# EAGLE board P1001-001-003-320 - Controller (EAGLE 9.4.2), part 1 of 3
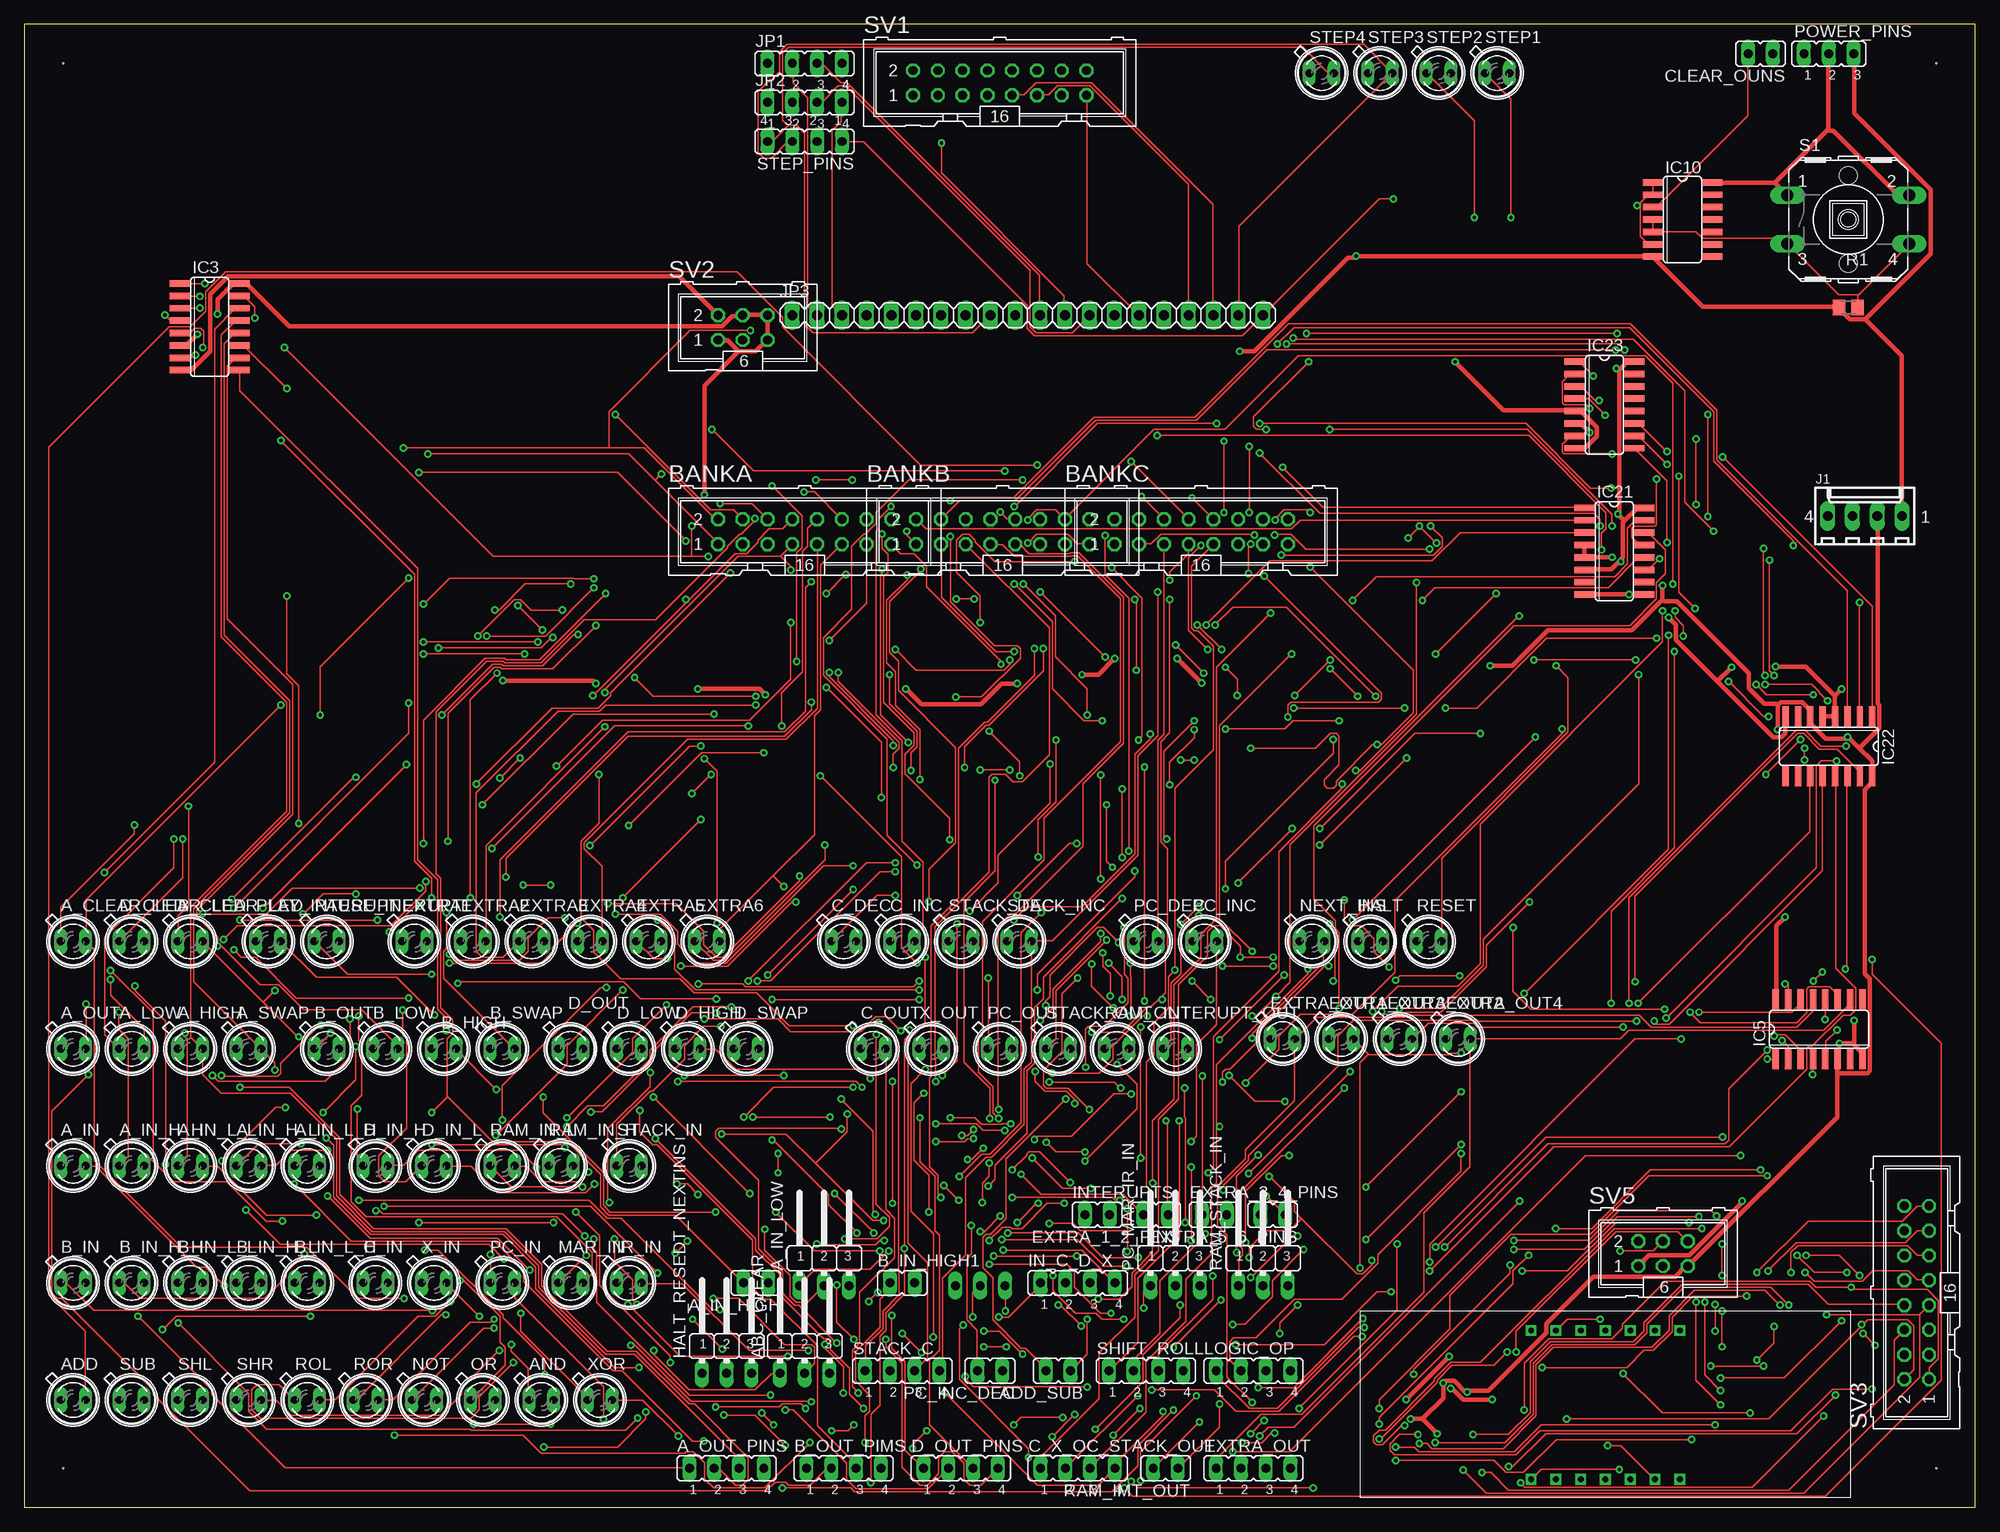
[diagram p4: board, top side]
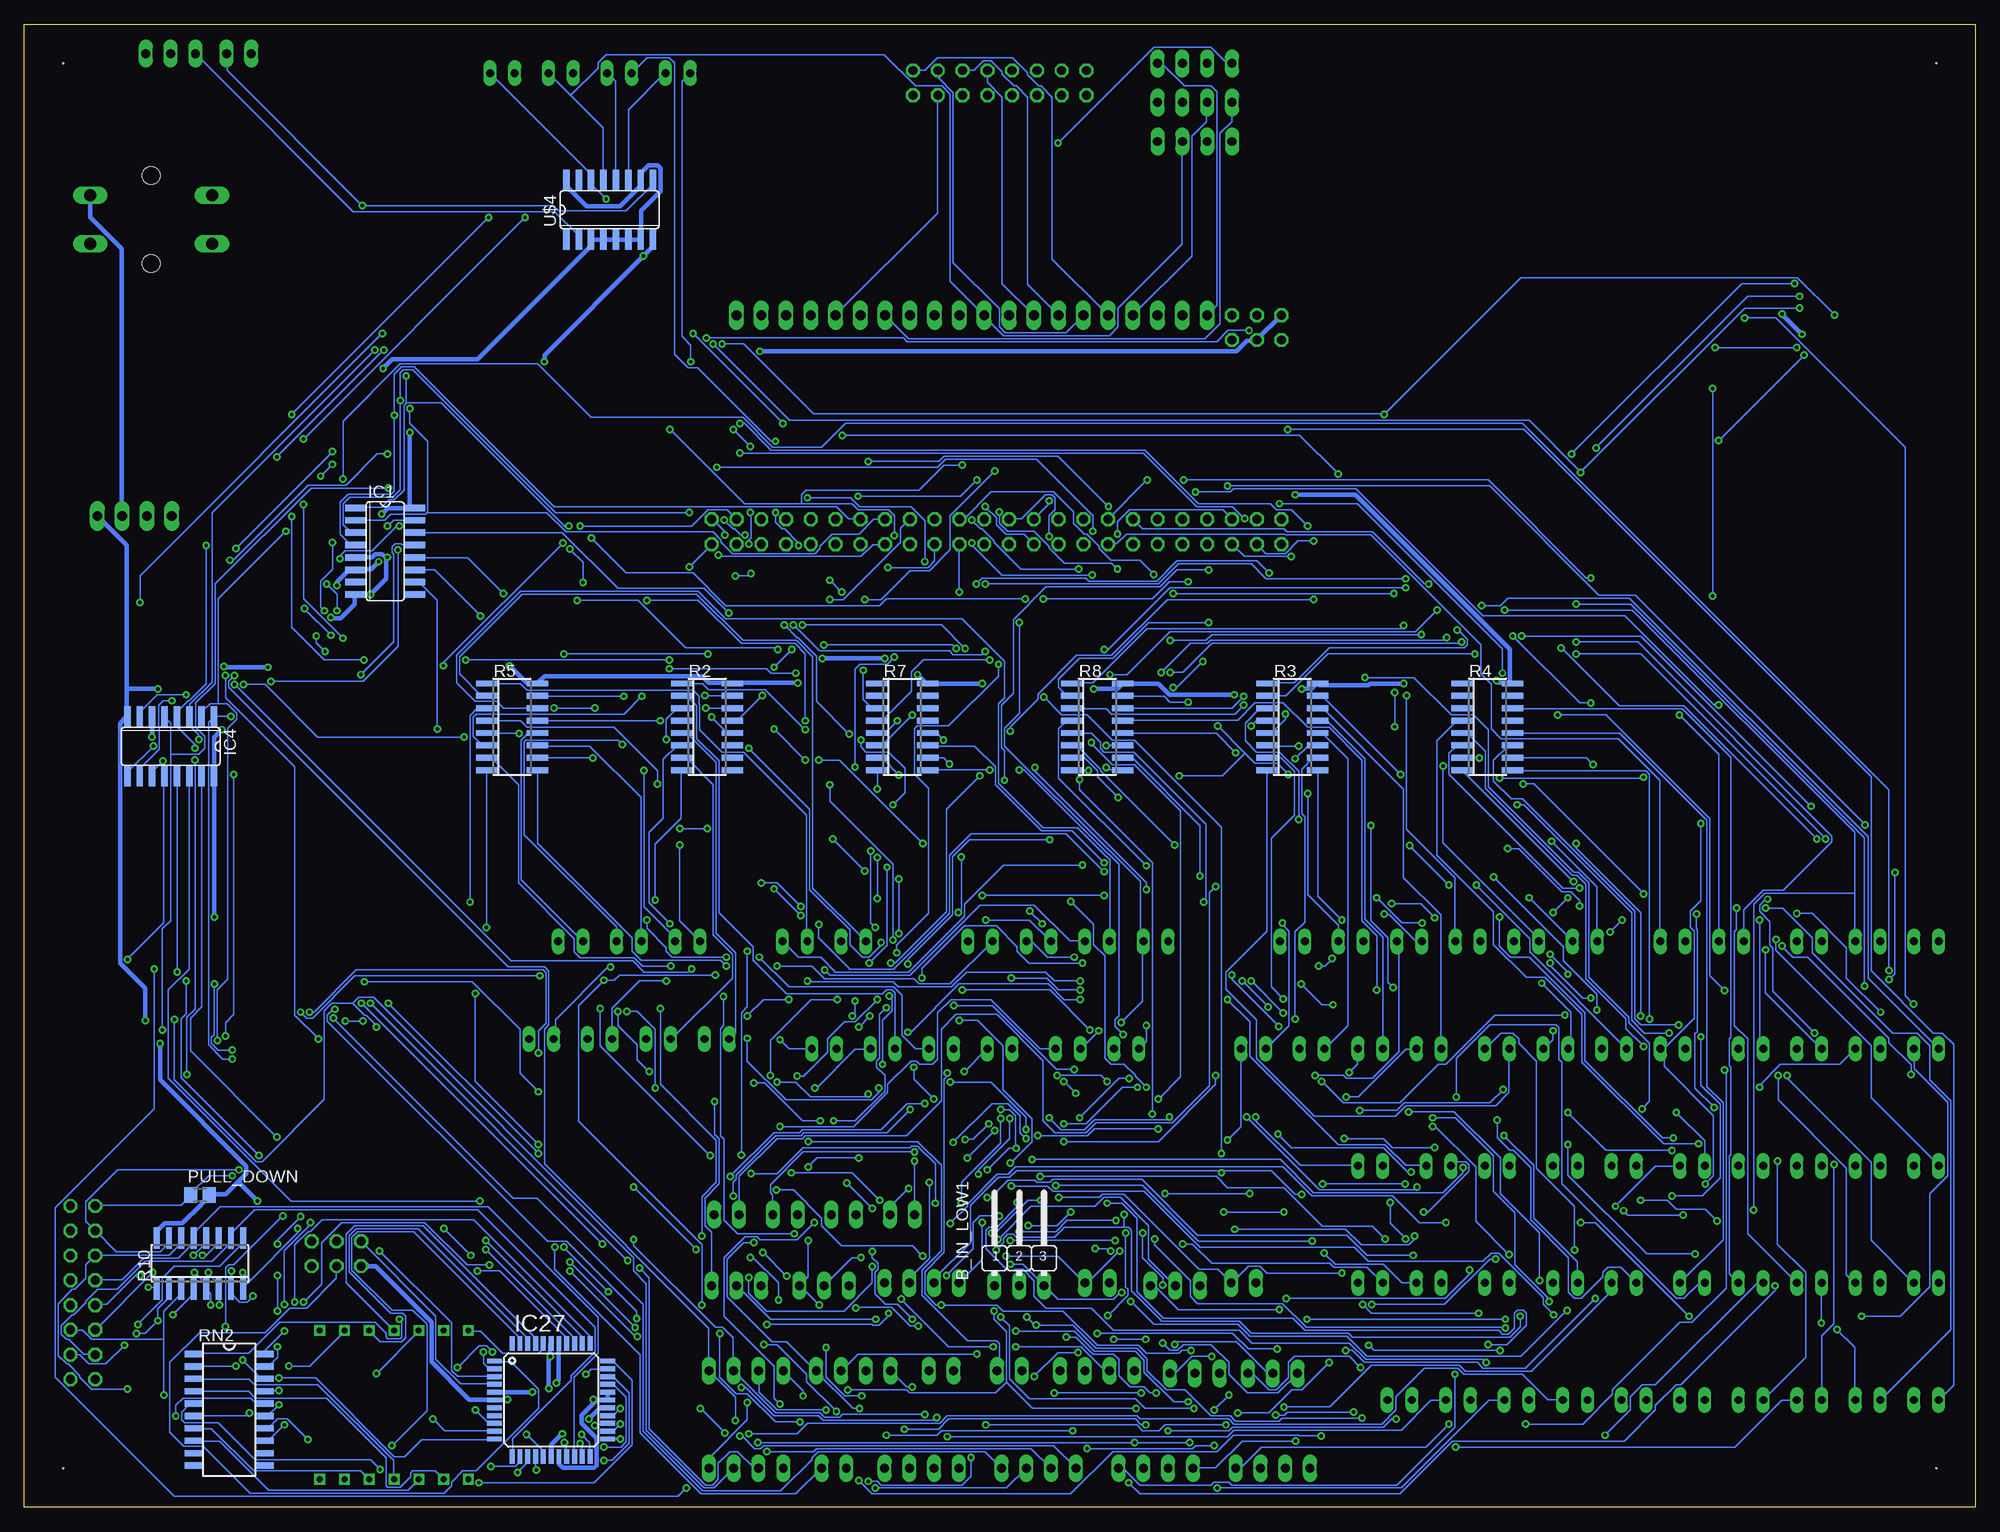
[diagram p5: board, bottom side, seen from below]

Size 200 x 152 mm. Coordinates in mm from the lower left corner, seen from the top.
Outline: 0,0 200,0 200,152 0,152 0,0
Copper layers (1*16): Top 0.035mm / dielectric 1.5mm / Bottom 0.035mm
Design rules "default *": minimum track width 6mil, minimum drill 0.35mm, track to track 6mil, track to pad 6mil, pad to pad 6mil, via to via 6mil, smd to smd 6mil, copper to edge 40mil, drill to drill 6mil, minimum pad ring 10mil, minimum via ring 8mil, stop-mask expansion 4mil, vias tented up to drill 0mil, thermal gap 10mil
Net classes: 1 power: width 0.457 mm
Holes 0.12 mm at 4,4 196,148 4,148 196,4

## Footprints (pad centres in the part's own frame; a part is rotated, then mirrored left to right if it is on the bottom)
SFH482 = drill 0.813 long: A -1.27,0; K 1.27,0
JP1 = drill 0.914 long: 1 0,-1.27; 2 0,1.27
JP2W = drill 0.914 long: 1 -2.54,-1.27; 2 0,-1.27; 3 2.54,-1.27
JP4 = drill 0.914 long: 1 -3.81,0; 2 -1.27,0; 3 1.27,0; 4 3.81,0
ML16 = drill 0.914 octagon: 1 -8.89,-1.27; 2 -8.89,1.27; 3 -6.35,-1.27; 4 -6.35,1.27; 5 -3.81,-1.27; 6 -3.81,1.27; 7 -1.27,-1.27; 8 -1.27,1.27; 9 1.27,-1.27; 10 1.27,1.27; 11 3.81,-1.27; 12 3.81,1.27; 13 6.35,-1.27; 14 6.35,1.27; 15 8.89,-1.27; 16 8.89,1.27
SO16 = smd 0.66 x 2.032: 1 -4.445,-3.073; 2 -3.175,-3.073; 3 -1.905,-3.073; 4 -0.635,-3.073; 5 0.635,-3.073; 6 1.905,-3.073; 7 3.175,-3.073; 8 4.445,-3.073; 9 4.445,3.073; 10 3.175,3.073; 11 1.905,3.073; 12 0.635,3.073; 13 -0.635,3.073; 14 -1.905,3.073; 15 -3.175,3.073; 16 -4.445,3.073
SO14 = smd 0.66 x 2.032: 1 -3.81,-3.073; 2 -2.54,-3.073; 3 -1.27,-3.073; 4 0,-3.073; 5 1.27,-3.073; 6 2.54,-3.073; 7 3.81,-3.073; 8 3.81,3.073; 9 2.54,3.073; 10 1.27,3.073; 11 0,3.073; 12 -1.27,3.073; 13 -2.54,3.073; 14 -3.81,3.073
TQFP44 = smd 1.5 x 0.5: 1 -5.8,4; 2 -5.8,3.2; 3 -5.8,2.4; 4 -5.8,1.6; 5 -5.8,0.8; 6 -5.8,0; 7 -5.8,-0.8; 8 -5.8,-1.6; 9 -5.8,-2.4; 10 -5.8,-3.2; 11 -5.8,-4; 23 5.8,-4; 24 5.8,-3.2; 25 5.8,-2.4; 26 5.8,-1.6; 27 5.8,-0.8; 28 5.8,0; 29 5.8,0.8; 30 5.8,1.6; 31 5.8,2.4; 32 5.8,3.2; 33 5.8,4 | smd 0.5 x 1.5: 12 -4,-5.8; 13 -3.2,-5.8; 14 -2.4,-5.8; 15 -1.6,-5.8; 16 -0.8,-5.8; 17 0,-5.8; 18 0.8,-5.8; 19 1.6,-5.8; 20 2.4,-5.8; 21 3.2,-5.8; 22 4,-5.8; 34 4,5.8; 35 3.2,5.8; 36 2.4,5.8; 37 1.6,5.8; 38 0.8,5.8; 39 0,5.8; 40 -0.8,5.8; 41 -1.6,5.8; 42 -2.4,5.8; 43 -3.2,5.8; 44 -4,5.8
6410-04 = drill 1.016 long: 1 3.81,0; 2 1.27,0; 3 -1.27,0; 4 -3.81,0
1X20 = drill 1.016 long: 1 -24.13,0; 2 -21.59,0; 3 -19.05,0; 4 -16.51,0; 5 -13.97,0; 6 -11.43,0; 7 -8.89,0; 8 -6.35,0; 9 -3.81,0; 10 -1.27,0; 11 1.27,0; 12 3.81,0; 13 6.35,0; 14 8.89,0; 15 11.43,0; 16 13.97,0; 17 16.51,0; 18 19.05,0; 19 21.59,0; 20 24.13,0
JP2 = drill 0.914 long: 1 -2.54,0; 2 0,0; 3 2.54,0
M0805 = smd 1.3 x 1.6: 1 -0.95,0; 2 0.95,0
SO16' = smd 0.6 x 2.2: 1 -4.445,-2.6; 2 -3.175,-2.6; 3 -1.905,-2.6; 4 -0.635,-2.6; 5 0.635,-2.6; 6 1.905,-2.6; 7 3.175,-2.6; 8 4.445,-2.6; 9 4.445,2.6; 10 3.175,2.6; 11 1.905,2.6; 12 0.635,2.6; 13 -0.635,2.6; 14 -1.905,2.6; 15 -3.175,2.6; 16 -4.445,2.6
SOMC20 = smd 1.91 x 0.64: 1 -3.62,5.715; 2 -3.62,4.445; 3 -3.62,3.175; 4 -3.62,1.905; 5 -3.62,0.635; 6 -3.62,-0.635; 7 -3.62,-1.905; 8 -3.62,-3.175; 9 -3.62,-4.445; 10 -3.62,-5.715; 11 3.62,-5.715; 12 3.62,-4.445; 13 3.62,-3.175; 14 3.62,-1.905; 15 3.62,-0.635; 16 3.62,0.635; 17 3.62,1.905; 18 3.62,3.175; 19 3.62,4.445; 20 3.62,5.715
B3F-40XX = drill 1.194 long: 1 -6.248,2.489; 2 6.248,2.489; 3 -6.248,-2.489; 4 6.248,-2.489 | hole 1.803: 0,-4.496; 0,4.496
ML6 = drill 0.914 octagon: 1 -2.54,-1.27; 2 -2.54,1.27; 3 0,-1.27; 4 0,1.27; 5 2.54,-1.27; 6 2.54,1.27
4-DIGIT-7-SEGMENT = drill 0.6 square: PIN1 17.48,1.88; PIN2 20.02,1.88; PIN3 22.56,1.88; PIN4 25.1,1.88; PIN5 27.64,1.88; PIN6 30.18,1.88; PIN7 32.72,1.88; PIN8 32.72,17.12; PIN9 30.18,17.12; PIN10 27.64,17.12; PIN11 25.1,17.12; PIN12 22.56,17.12; PIN13 20.02,17.12; PIN14 17.48,17.12

## Placement (x,y rotation side)
A_CLEAR_LED  [SFH482]  5,58 0 top
A_HIGH  [SFH482]  17,47 0 top
A_IN  [SFH482]  5,35 0 top
A_IN_H_H  [SFH482]  11,35 0 top
A_IN_H_L  [SFH482]  23,35 0 top
A_IN_HIGH  [JP1]  75,23 90 top
A_IN_L_H  [SFH482]  29,35 0 top
A_IN_L_L  [SFH482]  17,35 0 top
A_IN_LOW  [JP2W]  82,24 0 top
A_LOW  [SFH482]  11,47 0 top
A_OUT  [SFH482]  5,47 0 top
A_OUT_PINS  [JP4]  72,4 0 top
A_SWAP  [SFH482]  23,47 0 top
ABC_CLEAR  [JP2W]  80,15 0 top
ADD  [SFH482]  5,11 0 top
ADD_SUB  [JP1]  106,14 90 top
AND  [SFH482]  53,11 0 top
B_CLEAR_LED  [SFH482]  17,58 0 top
B_HIGH  [SFH482]  43,47 0 top
B_IN  [SFH482]  5,23 0 top
B_IN_H_H  [SFH482]  11,23 0 top
B_IN_H_L  [SFH482]  23,23 0 top
B_IN_HIGH1  [JP1]  90,23 270 top
B_IN_L_H  [SFH482]  29,23 0 top
B_IN_L_L  [SFH482]  17,23 0 top
B_IN_LOW1  [JP2W]  98,24 0 bottom
B_LOW  [SFH482]  37,47 0 top
B_OUT  [SFH482]  31,47 0 top
B_OUT_PIMS  [JP4]  84,4 0 top
B_SWAP  [SFH482]  49,47 0 top
BANKA  [ML16]  80,100 0 top
BANKB  [ML16]  100.32,100 0 top
BANKC  [ML16]  120.64,100 0 top
C_DEC  [SFH482]  84,58 0 top
C_IN  [SFH482]  36,23 0 top
C_INC  [SFH482]  90,58 0 top
C_OUT  [SFH482]  87,47 0 top
C_X_OC_STACK_OUT  [JP4]  108,4 0 top
CLEAR_OUNS  [JP1]  178,149 90 top
D_CLEAR_LED  [SFH482]  11,58 0 top
D_HIGH  [SFH482]  68,47 0 top
D_IN_H  [SFH482]  36,35 0 top
D_IN_L  [SFH482]  42,35 0 top
D_LOW  [SFH482]  62,47 0 top
D_OUT  [SFH482]  56,47 0 top
D_OUT_PINS  [JP4]  96,4 0 top
D_SWAP  [SFH482]  74,47 0 top
EXTRA1  [SFH482]  40,58 0 top
EXTRA2  [SFH482]  46,58 0 top
EXTRA3  [SFH482]  52,58 0 top
EXTRA4  [SFH482]  58,58 0 top
EXTRA5  [SFH482]  64,58 0 top
EXTRA6  [SFH482]  70,58 0 top
EXTRA_1_2_PINS  [JP1]  116,30 90 top
EXTRA_3_4_PINS  [JP1]  122,30 270 top
EXTRA_5_6_PINS  [JP1]  128,30 90 top
EXTRA_OUT  [JP4]  126,4 0 top
EXTRA_OUT1  [SFH482]  129,48 0 top
EXTRA_OUT2  [SFH482]  141,48 0 top
EXTRA_OUT3  [SFH482]  135,48 0 top
EXTRA_OUT4  [SFH482]  147,48 0 top
HALT  [SFH482]  138,58 0 top
HALT_RESEDT_NEXTINS  [JP2W]  72,15 0 top
IC1  74LS138D  [SO16]  163,98 270 bottom
IC3  74LS138D  [SO16]  19,121 270 top
IC4  74LS138D  [SO16]  185,78 180 bottom
IC5  74LS138D  [SO16]  184,49 0 top
IC10  74ALS00D  [SO14]  170,132 270 top
IC21  74LS138D  [SO16]  163,98 270 top
IC22  74LS138D  [SO16]  185,78 180 top
IC23  74LS138D  [SO16]  162,113 270 top
IC27  MEGA8535-A  [TQFP44]  146,11 0 bottom
IN_C_D_X  [JP4]  108,23 0 top
INTERUPT_OUT  [SFH482]  118,47 0 top
INTERUPTS  [JP1]  110,30 270 top
IR_IN  [SFH482]  62,23 0 top
J1  22-27-2041-04  [6410-04]  188.7,101.61 0 top
JP1  [JP4]  80,148 0 top
JP2  [JP4]  80,144 0 top
JP3  [1X20]  102.86,122.19 0 top
LOGIC_OP  [JP4]  126,14 0 top
MAR_IN  [SFH482]  56,23 0 top
NEXT_INS  [SFH482]  132,58 0 top
NOT  [SFH482]  41,11 0 top
OR  [SFH482]  47,11 0 top
PAUSE_INERUPT  [SFH482]  31,58 0 top
PC_DEC  [SFH482]  115,58 0 top
PC_IN  [SFH482]  49,23 0 top
PC_INC  [SFH482]  121,58 0 top
PC_INC_DEC  [JP1]  99,14 90 top
PC_MAR_IR_IN  [JP2W]  118,24 0 top
PC_OUT  [SFH482]  100,47 0 top
PLAY_INTERUPT  [SFH482]  25,58 0 top
POWER_PINS  [JP2]  185,149 0 top
PULL_DOWN  [M0805]  182,32 0 bottom
R1  [M0805]  187,123 0 top
R2  [SO16']  130,80 270 bottom
R3  [SO16']  70,80 270 bottom
R4  [SO16']  50,80 270 bottom
R5  [SO16']  150,80 270 bottom
R7  [SO16']  110,80 270 bottom
R8  [SO16']  90,80 270 bottom
R10  [SO16']  182,25 0 bottom
RAM_IMT_OUT  [JP1]  117,4 90 top
RAM_IN_H  [SFH482]  55,35 0 top
RAM_IN_L  [SFH482]  49,35 0 top
RAM_OUT  [SFH482]  112,47 0 top
RAM_STACK_IN  [JP2W]  127,24 0 top
RESET  [SFH482]  144,58 0 top
RN2  [SOMC20]  179,10 0 bottom
ROL  [SFH482]  29,11 0 top
ROR  [SFH482]  35,11 0 top
S1  [B3F-40XX]  187,132 0 top
SHIFT_ROLL  [JP4]  115,14 0 top
SHL  [SFH482]  17,11 0 top
SHR  [SFH482]  23,11 0 top
STACK_C  [JP4]  90,14 0 top
STACK_DEC  [SFH482]  96,58 0 top
STACK_IN  [SFH482]  62,35 0 top
STACK_INC  [SFH482]  102,58 0 top
STACK_OUT  [SFH482]  106,47 0 top
STEP1  [SFH482]  151,147 0 top
STEP2  [SFH482]  145,147 0 top
STEP3  [SFH482]  139,147 0 top
STEP4  [SFH482]  133,147 0 top
STEP_PINS  [JP4]  80,140 180 top
SUB  [SFH482]  11,11 0 top
SV1  [ML16]  100,146 0 top
SV2  [ML6]  73.65,120.92 0 top
SV3  [ML16]  194,22 90 top
SV5  [ML6]  168,26 0 top
U$1  4-DIGIT-7-SEGMENT  [4-DIGIT-7-SEGMENT]  137,1 0 top
U$4  SN74HC161  [SO16]  140,133 0 bottom
X_IN  [SFH482]  42,23 0 top
X_OUT  [SFH482]  93,47 0 top
XOR  [SFH482]  59,11 0 top

## Tracks (layer width: path | path; a pad name or v marks a point on that pad's centre or on a via)
!CLEAR  (via drill 0.35)
  Top 0.152: 165.66,133.43 165.66,133.73 166.42,134.49 166.88,134.49 IC10.2 166.95,134.57 166.95,135.79 IC10.1 | 165.66,133.43 165.66,130.3 166.5,129.46 166.88,129.46 IC10.6 | 165.66,133.43 v165.35,133.43
  Bottom 0.152: U$4.9 135.56,136.02 135.56,135.64 138.3,132.89 145.24,132.89 145.77,133.43 v165.35,133.43 179.22,147.29 179.22,148.97 CLEAR_OUNS.1
A  (via drill 0.35)
  Top 0.152: v153.54,24.23 158.19,24.23 163.14,29.18 v170.69,29.18 | v173.35,18.06 v173.35,20.8
  Bottom 0.152: v153.54,24.23 151.26,24.23 144.47,17.45 144.47,16.84 IC27.37 | v170.69,29.18 170.69,28.96 173.35,26.29 v173.35,20.8 | v173.35,18.06 175.34,16.08 175.34,15.77 RN2.20
B  (via drill 0.35)
  Top 0.152: v152.71,26.44 159.94,26.44 163.3,29.79 v171.68,29.79 | v174.04,23.77 v174.04,26.98 | v174.04,16.46 v174.04,20.12
  Bottom 0.152: v152.71,26.44 143.64,17.37 143.64,16.84 IC27.36 | v171.68,29.79 174.04,27.43 v174.04,26.98 | v174.04,20.12 v174.04,23.77 | v174.04,16.46 174.04,15.39 174.96,14.48 175.34,14.48 RN2.19
C  (via drill 0.35)
  Top 0.152: v152.71,27.36 160.4,27.36 163.45,30.4 172.97,30.4 v173.51,29.87 | v179.38,18.52 179.38,16.84 v177.62,15.09
  Bottom 0.152: v152.71,27.36 142.88,17.53 142.88,16.84 IC27.35 | v173.51,29.87 178.54,24.84 179.07,24.84 179.38,24.54 v179.38,18.52 | v177.62,15.09 175.72,13.18 175.41,13.18 RN2.18
CLEAR
  Top 0.152: IC10.3 166.95,133.27 167.34,133.27 176.71,142.65 176.71,148.97 CLEAR_OUNS.2
CLK
  Bottom 0.152: U$4.2 143.18,130 143.18,130.38 145.62,132.82 166.27,132.82 182.42,148.97 POWER_PINS.1
D  (via drill 0.35)
  Top 0.152: v172.29,21.03 172.29,13.56 v173.89,11.96
  Bottom 0.152: v172.29,21.03 172.29,26.9 170.92,28.27 170.69,28.27 169.47,29.49 153.92,29.49 142.04,17.6 142.04,16.84 IC27.34 | v173.89,11.96 175.34,11.96 RN2.17
DATAA0  (via drill 0.35)
  Top 0.152: v178.69,45.95 179.53,45.95 IC5.1 | v18.52,125.42 16,125.42 IC3.1 | v41.38,107.97 61.95,107.97 64.66,105.27 | 64.66,105.27 71.17,98.75 BANKA.1 | v178.84,81.08 178.31,81.08 v174.73,84.66 | v161.7,98.15 161.7,99.82 162.15,100.28 162.15,101.96 154.23,109.88 v116.13,109.88 | 64.66,105.27 v65.3,105.92
  Bottom 0.152: v178.69,45.95 179.68,45.95 181.13,47.4 181.13,80.47 180.59,81 IC4.1 180.52,81.08 v178.84,81.08 | v18.52,125.42 23.93,125.42 v41.38,107.97 | v174.73,84.66 165.28,84.66 161.7,88.24 v161.7,98.15 | v116.13,109.88 69.27,109.88 v65.3,105.92
DATAA1  (via drill 0.35)
  Top 0.152: v180.21,47.85 180.82,47.24 180.82,45.95 IC5.2 | v17.98,124.13 16,124.13 IC3.2 | 59.97,108.58 63.55,108.58 70.79,101.35 71.09,101.35 BANKA.2 | 59.97,108.58 v38.86,108.58 | v173.2,100.05 170.23,103.02 170.23,114.45 164.97,119.71 130.23,119.71 v130.07,119.86 | v74.45,120.62 68.28,120.62 59.97,112.32 59.97,108.58
  Bottom 0.152: v180.21,47.85 180.21,53.03 179.15,54.1 179.15,79.86 178.23,80.77 178.23,81.38 179.22,82.37 180.14,82.37 | 180.14,82.37 180.97,82.37 181.81,81.53 IC4.2 | v17.98,124.13 23.32,124.13 v38.86,108.58 | 180.14,82.37 180.14,93.12 v173.2,100.05 | v130.07,119.86 109.88,119.86 109.5,119.48 77.72,119.48 76.58,120.62 v74.45,120.62
DATAA2  (via drill 0.35)
  Top 0.152: v179.38,48.31 179.53,48.46 180.52,48.46 182.04,46.94 182.04,45.95 IC5.3 | v182.12,78.72 v178.54,75.13 | v17.98,122.91 16,122.91 IC3.3 | v40.46,106.07 60.81,106.07 v67.82,99.06 | v164.06,118.64 163.45,119.25 v129.39,119.25
  Bottom 0.152: v179.38,48.31 179.38,49.68 178.54,50.52 v178.54,75.13 | v182.12,78.72 182.12,79.17 183.03,80.09 183.03,81 IC4.3 183.03,81.08 183.03,82.3 180.75,84.58 180.75,101.96 v164.06,118.64 | v17.98,122.91 23.62,122.91 v40.46,106.07 40.46,106.15 45.72,111.4 121.54,111.4 v129.39,119.25 | v67.82,99.06 69.42,99.06 70.71,97.77 72.69,97.77 73.61,98.68 BANKA.3
DATAA3  (via drill 0.35)
  Top 0.152: v183.34,44.35 183.34,45.87 IC5.4 | v182.5,77.8 v182.5,76.58 | v14.4,122.22 14.94,121.69 15.93,121.69 IC3.4 | v60.58,112.01 70.33,102.26 72.69,102.26 73.61,101.35 BANKA.4 | v181.36,98.6 181.36,99.06 173.2,107.21 173.2,112.32 164.59,120.93 130.15,120.93 v128.47,119.25
  Bottom 0.152: v183.34,44.35 183.34,50.22 182.5,51.05 v182.5,76.58 | v182.5,77.8 182.5,78.18 184.33,80.01 184.33,81 IC4.4 184.33,81.08 184.33,81.53 183.19,82.68 183.11,82.68 181.36,84.43 v181.36,98.6 | v14.4,122.22 18.21,126.03 46.56,126.03 v60.58,112.01 60.58,112.09 119.1,112.09 126.26,119.25 v128.47,119.25
DATAA4  (via drill 0.35)
  Top 0.152: v185.85,48.92 184.71,47.78 184.71,45.95 IC5.5 | v18.29,118.87 18.36,118.95 18.36,120.55 18.06,120.85 17.45,120.85 16.99,120.4 16,120.4 IC3.5 | v26.67,118.87 48.08,97.46 68.43,97.46 | v70.1,97.46 68.43,97.46 | v162.69,104.47 160.55,104.47 153.92,111.1 v126.64,111.1 | 68.43,97.46 v68.43,100.58
  Bottom 0.152: v185.85,48.92 185.85,59.28 185.01,60.12 185.01,77.19 | 185.01,77.19 185.01,80.39 185.62,81 IC4.5 | v26.67,118.87 v18.29,118.87 | v70.1,97.46 74.91,97.46 76.12,98.68 BANKA.5 | 185.01,77.19 182.12,77.19 181.51,77.8 181.51,79.02 182.42,79.93 182.42,82.45 180.44,84.43 180.44,94.64 170.61,104.47 v162.69,104.47 | v126.64,111.1 126.19,111.1 123.44,108.36 85.11,108.36 79.63,102.87 72.24,102.87 71.63,102.26 70.1,102.26 v68.43,100.58
DATAA5  (via drill 0.35)
  Top 0.152: v45.72,62.48 45.72,82.75 v48.46,85.5 | v71.32,102.87 74.6,102.87 76.12,101.35 BANKA.6 | v117.04,39.62 117.2,39.47 117.2,30.02 EXTRA_1_2_PINS.1 | v111.63,51.21 109.42,53.42 v109.42,55.7 | v94.87,68.43 94.87,70.64 90.3,75.21 90.3,77.19 91.21,78.11 91.21,79.4 88.09,82.53 88.09,95.4 88.54,95.86 88.54,97.69 87.94,98.3 v87.94,99.75
  Bottom 0.152: v45.72,62.48 41.3,58.06 EXTRA1.K | v48.46,85.5 48.46,88.01 63.32,102.87 v71.32,102.87 | v117.04,39.62 114.83,39.62 111.78,42.67 111.78,44.27 112.62,45.11 112.62,45.72 112.32,46.02 112.32,50.52 v111.63,51.21 | v109.42,55.7 109.42,56.16 104.85,60.73 104.85,66.67 103.1,68.43 v94.87,68.43 | v87.94,99.75 87.94,101.04 86.72,102.26 77.11,102.26 76.2,101.35 BANKA.6
DATAA6  (via drill 0.35)
  Top 0.152: v59.51,80.01 47.32,67.82 47.32,58.06 EXTRA2.K | v59.51,83.52 59.51,83.82 73.15,97.46 77.5,97.46 77.53,97.5 | 77.53,97.5 78.72,98.68 BANKA.7 | v102.18,34.14 104.24,32.08 112.62,32.08 114.68,30.02 EXTRA_1_2_PINS.2 | v98.98,39.85 98.98,42.98 96.32,45.64 96.32,62.03 99.52,65.23 v99.52,74.52 | v78.56,96.09 78.56,96.47 77.53,97.5
  Bottom 0.152: v59.51,83.52 v59.51,80.01 | v102.18,34.14 102.18,34.59 98.98,37.8 v98.98,39.85 | v99.52,74.52 99.52,77.57 99.82,77.88 99.82,82.22 98.6,83.44 98.6,90.98 95.25,94.34 83.59,94.34 81.84,96.09 v78.56,96.09
DATAA7  (via drill 0.35)
  Top 0.152: 67.97,92.89 72.85,97.77 74.07,97.77 75.21,98.91 75.21,99.14 76.35,100.28 77.72,100.28 78.72,101.27 BANKA.8 | 67.97,92.89 v58.29,83.21 | v120.78,44.2 120.78,30.02 EXTRA_3_4_PINS.1 | v112.55,52.05 112.55,54.41 v111.18,55.78 | v102.03,74.98 102.03,76.43 v98.91,79.55 | 67.97,92.89 v67.82,93.04
  Bottom 0.152: v58.29,83.21 58.29,69.49 53.34,64.54 53.34,58.06 EXTRA3.K | v120.78,44.2 120.09,44.2 117.65,46.63 117.65,48.01 115.9,49.76 114.83,49.76 v112.55,52.05 | v111.18,55.78 110.72,55.78 105.46,61.04 105.46,71.55 v102.03,74.98 | v98.91,79.55 98.91,80.01 96.09,82.83 96.09,83.36 92.13,87.33 88.54,87.33 82.83,93.04 v67.82,93.04
DATAA8  (via drill 0.35)
  Top 0.152: EXTRA4.K 59.21,58.06 59.21,65.68 57.38,67.51 57.38,68.12 67.97,78.72 78.11,78.72 81.31,81.92 81.31,98.68 BANKA.9 | v108.74,36.42 105.77,36.42 v104.78,37.41 | v97.31,37.8 96.7,37.8 96.39,37.49 v93.42,37.49 | v67.67,44.27 v77.88,44.27
  Bottom 0.152: v108.74,36.42 120.17,36.42 123.52,33.07 123.52,32.23 123.29,32 123.29,30.02 EXTRA_3_4_PINS.2 | v104.78,37.41 100.81,41.38 99.14,41.38 97.92,40.16 97.92,38.41 v97.31,37.8 | v93.42,37.49 83.74,37.49 77.88,43.36 v77.88,44.27 | v67.67,44.27 64.77,44.27 64.47,43.97 61.8,43.97 59.05,46.71 59.05,57.84 59.21,57.99 EXTRA4.K
DATAA9  (via drill 0.35)
  Top 0.152: v70.41,75.13 v68.43,73.15 | v77.65,80.09 77.65,83.52 79.78,85.65 79.78,97.99 80.31,98.53 80.31,100.36 81.23,101.27 BANKA.10 | v127.33,31.93 129.24,30.02 EXTRA_5_6_PINS.1 | v109.19,40.77 106.98,42.98 104.78,42.98 104.47,43.28 104.47,44.81 106.38,46.71 106.38,52.65 v107.97,54.25 | v91.52,55.78 89.92,57.38 89.92,66.67 v81.61,74.98
  Bottom 0.152: v68.43,73.15 68.43,62.79 65.3,59.66 65.3,58.06 EXTRA5.K | v70.41,75.13 71.55,76.28 73.84,76.28 74.87,77.31 | v77.65,80.09 74.87,77.31 | v127.33,31.93 127.33,33.3 127.03,33.6 127.03,34.06 122.99,38.1 120.4,38.1 120.09,38.41 111.56,38.41 v109.19,40.77 | v107.97,54.25 107.97,55.24 103.63,59.59 100.36,59.59 98.22,57.45 98.22,57 97,55.78 v91.52,55.78 | v81.61,74.98 77.19,74.98 74.87,77.31
DATAA10  (via drill 0.35)
  Top 0.152: 76.77,64.73 81,68.96 81,81.15 81.61,81.76 81.61,96.55 83.74,98.68 BANKA.11 | 76.77,64.73 71.32,59.28 71.32,58.06 EXTRA6.K | 76.77,64.73 v77.88,63.63
  Bottom 0.152: v77.88,63.63 78.49,63.02 78.49,43.2 82.3,39.4 90.14,39.4 91.14,38.41 94.34,38.41 95.56,39.62 95.56,45.8 100.28,50.52 104.47,50.52 105.99,49 105.99,41.68 109.58,38.1 119.94,38.1 120.24,37.8 122.83,37.8 126.72,33.91 126.72,30.02 EXTRA_5_6_PINS.2
DATAA11  (via drill 0.35)
  Top 0.152: v26.29,82.22 6.33,62.26 6.33,58.06 A_CLEAR_LED.K 6.33,57.99 7.16,57.15 7.16,35.59 16.08,26.67 28.96,26.67 34.21,21.41 v38.94,21.41 | v79.93,104.09 81,104.09 83.74,101.35 BANKA.12 | v64.54,16.08 64.54,15.62 68.12,12.04 74.91,12.04 76.58,13.72 77.42,13.72 ABC_CLEAR.1
  Bottom 0.152: v26.29,82.22 26.75,82.22 35.89,91.36 50.44,91.36 63.48,104.39 76.05,104.39 76.35,104.09 v79.93,104.09 | v64.54,16.08 63.86,16.08 62.64,14.86 51.05,14.86 50.44,14.25 46.1,14.25 v38.94,21.41
DATAA12  (via drill 0.35)
  Top 0.152: 24.5,51.78 28.04,48.23 v28.12,48.23 | 24.5,51.78 18.29,57.99 B_CLEAR_LED.K | v31.09,31.93 35.43,27.58 48.54,27.58 v51.82,24.31 | v70.64,21.41 73.23,21.41 77.95,16.69 80.7,16.69 81,16.38 81,14.78 80.01,13.79 ABC_CLEAR.2 | v82.53,88.85 86.33,92.66 86.33,98.68 BANKA.13 | v56.77,89.46 56.31,89.46 53.11,86.26 49.07,86.26 48.92,86.41 48.01,86.41 v42.82,81.23 | 24.5,51.78 v25.68,52.96
  Bottom 0.152: v28.12,48.23 28.12,43.28 26.14,41.3 26.14,33.76 27.96,31.93 v31.09,31.93 | v51.82,24.31 51.82,23.93 54.33,21.41 v70.64,21.41 | v82.53,88.85 78.87,88.85 78.26,89.46 v56.77,89.46 | v42.82,81.23 37.87,81.23 27.2,70.56 27.2,54.48 v25.68,52.96
DATAA13  (via drill 0.35)
  Top 0.152: v48.23,91.97 48.69,91.97 51.36,94.64 v56.01,94.64 | v78.26,15.47 67.21,15.47 v61.87,20.8 | v49.15,25.45 47.62,26.98 26.21,26.98 v22.71,30.48
  Bottom 0.152: 12.34,62.94 12.34,69.19 35.13,91.97 v48.23,91.97 | 12.34,62.94 12.34,58.06 D_CLEAR_LED.K | v56.01,94.64 56.46,94.64 61.8,99.97 70.56,99.97 70.87,100.28 85.34,100.28 86.33,101.27 BANKA.14 | v78.26,15.47 80.31,15.47 81.99,13.79 82.53,13.79 ABC_CLEAR.3 | v61.87,20.8 54.41,20.8 49.76,25.45 v49.15,25.45 | v22.71,30.48 22.71,61.8 21.57,62.94 12.34,62.94
DATAA14  (via drill 0.35)
  Top 0.152: v108.74,35.51 114.07,40.84 114.07,43.36 v112.01,45.41 | v111.33,52.43 111.33,54.71 110.57,55.47 v110.57,56.84 | v100.13,86.41 100.13,86.72 92.51,94.34 92.51,96.47 91.21,97.77 89.84,97.77 88.92,98.68 BANKA.15
  Bottom 0.152: PAUSE_INERUPT.K 32.31,58.06 32.31,74.52 36.58,78.79 48.62,78.79 49.61,79.78 49.61,84.35 50.67,85.42 50.67,88.39 61.95,99.67 70.71,99.67 70.79,99.75 87.02,99.75 88.01,98.75 88.85,98.75 BANKA.15 | v108.74,35.51 108.74,30.02 INTERUPTS.1 | v112.01,45.41 112.01,49.91 111.02,50.9 111.02,52.12 v111.33,52.43 | v110.57,56.84 110.57,57.61 107.29,60.88 107.29,73.69 108.74,75.13 108.74,79.78 108.43,80.09 105.23,80.09 100.13,85.19 v100.13,86.41
DATAA15  (via drill 0.35)
  Top 0.152: v30.33,81.23 30.33,86.18 v39.4,95.25 | v84.89,105.31 v81.15,105.31 | v109.35,32.69 106.45,32.69 v103.33,35.81 | v100.51,38.63 98.3,38.63 97.61,39.32 v93.42,39.32 | v85.88,43.05 85.27,43.66 v66.98,43.66 | v42.06,50.44 38.18,54.33 29.95,54.33 26.29,57.99 PLAY_INTERUPT.K
  Bottom 0.152: v30.33,81.23 26.29,77.19 26.29,58.06 PLAY_INTERUPT.K | v39.4,95.25 39.85,95.25 49.91,105.31 v81.15,105.31 | v84.89,105.31 88.85,101.35 BANKA.16 | v109.35,32.69 111.25,30.79 111.25,30.02 INTERUPTS.2 | v100.51,38.63 v103.33,35.81 | v93.42,39.32 91.14,39.32 87.4,43.05 v85.88,43.05 | v66.98,43.66 64.77,41.45 58.98,41.45 55.02,45.41 54.25,45.41 49.23,50.44 v42.06,50.44
DATAB0  (via drill 0.35)
  Top 0.152: v129.01,106.6 133.12,102.49 159.87,102.49 IC21.1 | v90.45,100.05 90.45,99.67 91.36,98.75 BANKB.1
  Bottom 0.152: v129.01,106.6 106.38,106.6 105.54,107.44 96.24,107.44 90.45,101.65 v90.45,100.05
DATAB1
  Top 0.152: IC21.2 159.87,101.19 130.84,101.19 129.92,100.28 92.43,100.28 BANKB.2
DATAB2  (via drill 0.35)
  Top 0.152: v121.16,90.45 127.71,97 144.32,97 147.22,99.9 159.87,99.9 IC21.3 | v101.5,87.71 99.59,87.71 94.03,93.27 94.03,98.68 BANKB.3
  Bottom 0.152: v121.16,90.45 118.49,87.78 105.16,87.78 104.78,87.4 101.8,87.4 v101.5,87.71
DATAB3  (via drill 0.35)
  Top 0.152: v174.12,107.67 189.43,92.35 IC22.1 | v163.14,118.64 127.41,118.64 120.17,111.4 109.8,111.4 101.58,103.17 95.86,103.17 94.03,101.35 BANKB.4
  Bottom 0.152: v163.14,118.64 v174.12,107.67
DATAB4  (via drill 0.35)
  Top 0.152: v188.14,92.73 188.14,81.08 IC22.2 | v131.44,120.32 v163.3,120.32 | v122.22,111.1 110.03,111.1 v101.5,102.56 | v97.08,28.88 97.08,25.98 96.62,25.53 96.62,19.2 97.69,18.14 97.69,14.02 PC_INC_DEC.2 | v92.73,30.25 92.73,34.06 91.21,35.59 91.21,41.45 v92.2,42.44 | v93.42,43.66 93.42,45.87 93.34,45.95 93.34,59.51 98.91,65.08 98.91,74.83 99.21,75.13 100.58,75.13 101.35,74.37 102.34,74.37 105.08,77.11 105.08,90.14 96.55,98.68 BANKB.5
  Bottom 0.152: v188.14,92.73 188.14,95.48 v163.3,120.32 | v122.22,111.1 v131.44,120.32 | v101.5,102.56 100.36,101.42 100.36,100.74 99.36,99.75 97.54,99.75 96.55,98.75 BANKB.5 | v97.08,28.88 94.11,28.88 v92.73,30.25 | v93.42,43.66 v92.2,42.44
DATAB5  (via drill 0.35)
  Top 0.152: v94.94,103.17 95.25,103.48 101.42,103.48 109.65,111.71 120.02,111.71 129.62,121.31 164.67,121.31 173.51,112.47 173.51,107.37 186.92,93.95 IC22.3
  Bottom 0.152: v94.94,103.17 94.94,102.87 96.47,101.35 BANKB.6
DATAB6  (via drill 0.35)
  Top 0.152: v70.87,10.29 77.42,10.29 77.72,10.59 79.63,10.59 v80.09,10.13 | v99.9,19.51 100.89,19.51 104.17,22.78 104.17,22.94 IN_C_D_X.1 | v99.9,39.85 99.29,40.46 99.29,43.13 97.84,44.58 97.84,48.08 98.22,48.46 98.22,60.05 104.55,66.37 104.55,70.64 112.39,78.49 112.39,93.12 107.97,97.54 107.37,97.54 107.29,97.46 101.5,97.46 100.28,98.68 99.06,98.68 BANKB.7 | v103.94,31.17 103.78,31.17 v101.8,29.18
  Bottom 0.152: v70.87,10.29 66.14,10.29 61.87,14.55 52.88,14.55 52.27,13.95 45.49,13.95 37.34,22.1 37.34,22.94 C_IN.K | v80.09,10.13 85.11,10.13 86.11,11.12 96.93,11.12 98.98,13.18 98.98,18.59 v99.9,19.51 | v99.9,39.85 99.9,37.34 103.94,33.3 v103.94,31.17 | v101.8,29.18 101.8,25.38 104.17,23.01 IN_C_D_X.1
DATAB7  (via drill 0.35)
  Top 0.152: v58.45,33.15 57.53,32.23 48.54,32.23 45.8,34.98 43.28,34.98 D_IN_L.K | v66.9,33.15 67.97,33.15 v69.04,32.08 | v94.94,99.52 94.94,92.81 99.44,88.32 101.8,88.32 102.11,88.01 102.11,87.02 98.15,83.06 v95.48,83.06 | v77.27,34.29 v77.27,36.27
  Bottom 0.152: v66.9,33.15 v58.45,33.15 | v69.04,32.08 69.72,32.08 72.16,34.52 77.27,34.52 | 77.27,34.52 98.3,34.52 98.98,33.83 100.13,33.83 103.02,30.94 103.02,27.13 106.68,23.47 106.68,23.01 IN_C_D_X.2 | v94.94,99.52 94.94,101.65 94.34,102.26 94.34,103.48 94.64,103.78 95.33,103.78 97.77,101.35 98.98,101.35 BANKB.8 | v95.48,83.06 93.65,81.23 91.06,81.23 88.47,78.64 86.18,78.64 77.27,69.72 v77.27,36.27 | 77.27,34.52 v77.27,34.29
DATAB8  (via drill 0.35)
  Top 0.152: v52.5,34.82 50.75,36.58 40.39,36.58 38.86,35.05 37.34,35.05 D_IN_H.K | v96.7,35.66 97.16,35.66 v98.3,36.8 | v101.27,34.59 102.72,36.04 102.72,36.12 103.02,36.42 104.09,36.42 v107.21,33.3 | v99.9,40.77 99.82,40.84 99.82,59.51 101.12,60.81 101.58,60.81 108.51,67.74 108.51,74.14 112.7,78.33 112.7,93.27 108.13,97.84 107.21,97.84 107.14,97.77 103.02,97.77 102.11,98.68 101.65,98.68 BANKB.9
  Bottom 0.152: v52.5,34.82 52.5,34.29 54.56,32.23 67.82,32.23 71.25,35.66 v96.7,35.66 | 98.37,36.8 99.06,36.8 v101.27,34.59 | v107.21,33.3 107.21,25.53 109.19,23.55 109.19,23.01 IN_C_D_X.3 | v99.9,40.77 98.98,40.77 98.37,40.16 98.37,36.8 | 98.37,36.8 v98.3,36.8
DATAB9  (via drill 0.35)
  Top 0.152: v46.63,19.58 43.28,22.94 X_IN.K | v100.36,26.36 108.43,26.36 111.78,23.01 IN_C_D_X.4 | v100.05,102.03 100.74,101.35 101.58,101.35 BANKB.10 | v87.94,96.16 87.94,95.71 87.78,95.56 87.78,81.23 v90.6,78.41 | v83.74,41.83 87.02,38.56 87.02,30.25 v87.25,30.02
  Bottom 0.152: v46.63,19.58 46.63,18.52 47.7,17.45 63.86,17.45 64.24,17.83 74.22,17.83 75.44,19.05 83.36,19.05 86.49,22.17 86.49,28.42 86.79,28.73 87.25,28.73 | 87.25,28.73 93.34,28.73 94.41,27.66 98.3,27.66 98.6,27.96 99.21,27.96 99.59,27.58 99.59,27.13 v100.36,26.36 | v100.05,102.03 100.05,100.89 99.21,100.05 96.47,100.05 94.94,98.53 94.94,98.37 93.34,96.77 88.54,96.77 v87.94,96.16 | v90.6,78.41 90.6,78.26 88.47,76.12 86.18,76.12 81.46,71.4 81.46,44.12 v83.74,41.83 | 87.25,28.73 v87.25,30.02
DATAB10  (via drill 0.35)
  Top 0.152: v80.39,16.08 74.3,16.08 67.44,22.94 63.32,22.94 IR_IN.K | v105.99,20.73 106.22,20.73 v108.36,18.59 | v114.76,20.42 114.76,22.02 115.44,22.71 PC_MAR_IR_IN.1 | v110.8,87.17 v104.17,93.8 | v114.83,51.89 v114.83,75.89 | v115.14,50.37 114.68,50.37 111.63,47.32 111.63,45.95 110.19,44.5 v105.39,44.5
  Bottom 0.152: v80.39,16.08 81.31,16.08 81.61,15.77 84.96,15.77 85.8,16.61 89.99,16.61 93.5,20.12 99.67,20.12 100.28,20.73 v105.99,20.73 106.53,20.73 107.67,21.87 107.67,24.16 105.69,26.14 105.69,43.89 105.39,44.2 v105.39,44.5 | v108.36,18.59 109.19,18.59 111.1,20.5 114.68,20.5 v114.76,20.42 | v104.17,93.8 104.17,98.68 BANKB.11 | v110.8,87.17 111.18,86.79 111.18,86.72 111.48,86.41 114.3,86.41 114.83,85.88 v114.83,75.89 | v114.83,51.89 114.83,50.67 v115.14,50.37
DATAB11  (via drill 0.35)
  Top 0.152: v67.97,27.28 v66.75,26.06 | v95.78,31.47 v94.26,32.99 | v100.81,28.12 108.05,28.12 110.57,25.6 v114.22,25.6 | v82.22,93.65 v84.2,95.63 | v59.59,93.65 52.81,86.87 49.38,86.87 49.23,87.02 47.24,87.02 40.92,80.7 v40.92,68.05 | v34.29,50.37 34.29,47.85 34.59,47.55 34.59,42.22 33.53,41.15 33.53,31.32 35.05,29.79 54.56,29.79 58.22,26.14 58.22,23.93 57.3,23.01 MAR_IN.K
  Bottom 0.152: v66.75,26.06 65.61,24.92 60.66,24.92 58.75,23.01 57.3,23.01 MAR_IN.K | v67.97,27.28 79.63,27.28 85.34,32.99 v94.26,32.99 | v95.78,31.47 97.08,31.47 100.43,28.12 v100.81,28.12 | v114.22,25.6 115.14,25.6 117.96,22.78 PC_MAR_IR_IN.2 | v84.2,95.63 85.65,97.08 88.62,97.08 89.84,98.3 89.84,98.53 91.06,99.75 91.29,99.75 92.43,100.89 92.43,102.03 94.49,104.09 100.89,104.09 103.63,101.35 104.09,101.35 BANKB.12 | v59.59,93.65 v82.22,93.65 | v40.92,68.05 40.92,67.59 34.29,60.96 v34.29,50.37
DATAB12  (via drill 0.35)
  Top 0.152: v59.36,9.07 59.36,12.34 50.29,21.41 50.29,22.94 PC_IN.K | v82.75,7.85 84.43,7.85 v85.04,8.46 | v109.8,8 114.68,12.88 114.68,15.62 118.49,19.43 v118.49,20.73 | v111.48,96.32 114.61,93.19 114.61,79.02 v114.22,78.64 | v110.95,72.01 110.95,66.22 v111.56,65.61 | v113.39,55.78 113.39,54.48 113.46,54.41 113.46,50.52 v113.31,50.37 | v114.45,35.81 v114.45,49.23 | v119.63,27.36 v119.63,34.9
  Bottom 0.152: v59.36,9.07 59.82,9.07 60.66,8.23 76.12,8.23 76.5,7.85 v82.75,7.85 | v85.04,8.46 85.5,8.46 86.11,9.07 105.23,9.07 106.3,8 v109.8,8 | v118.49,20.73 120.47,22.71 PC_MAR_IR_IN.3 120.47,22.78 119.63,23.62 v119.63,27.36 | v111.48,96.32 107.37,96.32 106.68,97 106.68,98.68 BANKB.13 | v114.22,78.64 114.22,77.95 113.69,77.42 111.4,77.42 109.73,75.74 109.73,73.23 v110.95,72.01 | v111.56,65.61 111.56,57.61 v113.39,55.78 | v114.45,49.23 v113.31,50.37 | v114.45,35.81 118.72,35.81 v119.63,34.9
DATAB13  (via drill 0.35)
  Top 0.152: v73.76,40.01 76.81,43.05 v84.96,43.05 | v92.73,62.1 92.73,65.38 95.48,68.12 95.48,77.88 89.61,83.74 89.61,86.72 88.7,87.63 88.7,92.81 91.9,96.01 v91.9,96.16 | v102.87,101.19 102.87,101.35 103.78,102.26 105.69,102.26 106.6,101.35 BANKB.14 106.68,101.35 115.82,110.49 123.06,110.49 130.61,118.03 166.19,118.03 169.01,115.21 v169.01,94.64 | v135.33,42.98 124.59,32.23 124.59,26.82 124.89,26.52 124.89,25.83 124.51,25.45 124.51,22.78 RAM_STACK_IN.1 | v138.23,50.83 140.82,53.42 146.99,53.42 149.28,55.7 149.28,70.03 167.94,88.7 v167.94,91.9
  Bottom 0.152: v73.76,40.01 73.76,39.62 69.19,35.05 63.32,35.05 STACK_IN.K | v84.96,43.05 86.11,44.2 86.11,44.27 87.25,45.41 88.62,45.41 89.23,46.02 89.23,56.54 90.37,57.68 90.37,59.74 v92.73,62.1 | v91.9,96.16 97.84,96.16 100.58,98.91 100.58,99.06 101.8,100.28 101.96,100.28 v102.87,101.19 | v135.33,42.98 135.33,49 137.16,50.83 v138.23,50.83 | v167.94,91.9 167.94,93.57 v169.01,94.64
DATAB14  (via drill 0.35)
  Top 0.152: v57.84,34.37 56.84,33.38 53.03,33.38 51.44,34.98 50.29,34.98 RAM_IN_L.K | v71.48,38.25 78.11,38.25 81.11,35.24 | 81.11,35.24 86.94,29.41 v88.09,29.41 | v97.99,28.27 98.45,28.27 v100.05,29.87 | v105.46,23.77 105.46,22.17 107.75,19.89 109.88,19.89 110.49,19.28 v112.7,19.28 | v102.87,98.83 103.78,99.75 106.98,99.75 107.97,98.75 109.19,98.75 BANKB.15 | v90.53,95.56 90.53,95.1 88.39,92.96 88.39,86.56 89.31,85.65 89.31,82.22 91.82,79.7 v91.82,74.6 | v84.35,40.31 84.35,38.48 81.11,35.24
  Bottom 0.152: v57.84,34.37 58.14,34.37 60.66,36.88 70.1,36.88 v71.48,38.25 | v88.09,29.41 93.12,29.41 94.26,28.27 v97.99,28.27 | v100.05,29.87 102.03,29.87 102.72,29.18 102.72,26.52 v105.46,23.77 | v112.7,19.28 123.52,19.28 126.95,22.71 RAM_STACK_IN.2 | v102.87,98.83 102.87,98.68 99.75,95.56 v90.53,95.56 | v91.82,74.6 91.82,73.53 84.35,66.06 v84.35,40.31
DATAB15  (via drill 0.35)
  Top 0.152: v91.75,52.05 v76.66,52.05 | v109.42,48.69 112.55,48.69 115.14,51.28 115.52,51.28 116.47,52.23 | 116.47,52.23 116.97,52.73 116.97,56.77 117.2,57 117.2,67.51 116.51,68.2 116.51,78.49 117.42,79.4 v117.42,93.04 | v129.24,41.6 126.19,41.6 v123.52,44.27 | 116.47,52.23 v116.66,52.05
  Bottom 0.152: v76.66,52.05 74.37,49.76 74.37,46.25 65.3,37.19 60.5,37.19 58.37,35.05 56.31,35.05 RAM_IN_H.K | v91.75,52.05 93.42,52.05 95.02,53.65 104.17,53.65 109.12,48.69 v109.42,48.69 | v117.42,93.04 116.05,93.04 110.19,98.91 110.19,100.36 109.27,101.27 BANKB.16 | RAM_STACK_IN.3 129.54,28.19 130.23,28.88 130.23,31.7 128.78,33.15 128.78,37.8 129.24,38.25 v129.24,41.6 | v123.52,44.27 123.52,47.85 119.33,52.05 v116.66,52.05
DATAC0  (via drill 0.35)
  Top 0.152: v160.86,115.98 159.41,117.42 158.95,117.42 IC23.1 | v128.85,97.61 144.47,97.61 145.39,98.53 145.39,99.36 v144.17,100.58
  Bottom 0.152: v160.86,115.98 160.86,113.23 | 160.86,113.23 160.86,113.16 161.09,112.93 161.09,104.24 162.08,103.25 162.61,103.25 163.37,102.49 166.04,102.49 IC1.1 | v128.85,97.61 128.7,97.46 114.22,97.46 113,98.68 111.78,98.68 BANKC.1 | v144.17,100.58 144.63,100.58 157.28,113.23 160.86,113.23
DATAC1  (via drill 0.35)
  Top 0.152: v160.48,112.62 160.1,113 157.89,113 157.66,113.23 157.66,115.37 158.42,116.13 158.88,116.13 IC23.2
  Bottom 0.152: v160.48,112.62 160.48,111.1 158.65,109.27 158.65,102.03 158.69,101.99 | 158.69,101.99 158.88,101.8 162.46,101.8 163.07,101.19 166.04,101.19 IC1.2 | BANKC.2 111.78,101.27 112.93,101.27 114.45,99.75 117.2,99.75 118.42,98.53 118.42,98.3 118.95,97.77 127.41,97.77 128.55,98.91 128.55,99.14 129.39,99.97 144.47,99.97 146.46,101.96 158.65,101.96 158.69,101.99
DATAC2  (via drill 0.35)
  Top 0.152: v161.47,113.46 161.01,113.46 159.64,114.83 158.95,114.83 IC23.3 | v126.11,99.67 126.03,99.75 116.51,99.75 115.52,98.75 114.3,98.75 BANKC.3 | v128.25,101.19 128.25,101.35 129.16,102.26 131.52,102.26 v131.83,101.96
  Bottom 0.152: IC1.3 166.12,99.97 166.57,99.97 167.34,100.74 167.34,102.87 166.65,103.56 162.23,103.56 161.47,104.32 v161.47,113.46 161.47,116.28 161.16,116.59 160.17,116.59 145.54,101.96 v131.83,101.96 | v126.11,99.67 126.57,99.67 127.18,100.28 127.33,100.28 v128.25,101.19
DATAC3  (via drill 0.35)
  Top 0.152: v162.08,111.94 160.4,113.61 158.95,113.61 IC23.4
  Bottom 0.152: IC1.4 166.12,98.68 166.57,98.68 167.64,99.75 167.64,103.02 166.8,103.86 162.38,103.86 162.08,104.17 v162.08,111.94 162.08,116.13 161.31,116.89 160.02,116.89 145.69,102.56 116.74,102.56 115.52,101.35 114.3,101.35 BANKC.4
DATAC4
  Top 0.152: PC_DEC.K 116.2,58.06 116.2,78.64 116.81,79.25 116.81,98.68 BANKC.5
DATAC5  (via drill 0.35)
  Top 0.152: v119.63,37.49 120.17,38.02 120.17,47.4 122.22,49.45 122.22,57.99 PC_INC.K | v114.53,103.63 116.81,101.35 BANKC.6 | v102.34,105.31 90.68,105.31 87.33,101.96 87.33,100.89 86.18,99.75 86.03,99.75 84.81,98.53 84.81,92.05 81.92,89.15 81.92,85.27 88.47,78.72 88.47,68.89 v91.52,65.84
  Bottom 0.152: v119.63,37.49 108.43,37.49 105.99,35.05 105.99,26.29 107.97,24.31 107.97,21.72 103.33,17.07 100.36,17.07 100.05,16.76 100.05,14.17 100.2,14.02 PC_INC_DEC.1 | v114.53,103.63 104.01,103.63 v102.34,105.31 | v91.52,65.84 99.59,65.84 103.63,61.8 103.63,60.58 109.35,54.86 116.81,54.86 118.34,56.39 120.62,56.39 122.22,57.99 PC_INC.K
DATAC6  (via drill 0.35)
  Top 0.152: STACK_C.4 93.88,14.02 94.11,14.25 94.11,23.47 96.47,25.83 96.47,33.76 98.6,35.89 99.14,35.89 102.49,39.24 102.49,44.88 103.25,45.64 103.25,57.99 STACK_INC.K 103.33,58.06 105.39,58.06 114.15,66.83 114.15,77.04 116.2,79.1 v116.2,93.8 | v117.42,95.02 117.42,95.86 119.33,97.77 119.33,98.68 BANKC.7
  Bottom 0.152: v116.2,93.8 v117.42,95.02
DATAC7  (via drill 0.35)
  Top 0.152: STACK_C.3 91.29,14.02 92.58,15.32 92.58,25.07 90.6,27.05 90.6,47.85 92.35,49.61 v92.35,56.39 92.35,58.9 92.13,59.13 92.13,66.14 89.99,68.28 89.99,78.56 87.33,81.23 87.33,100.05 87.63,100.36 87.63,101.35 v88.85,102.56 | v113.46,107.21 119.33,101.35 BANKC.8
  Bottom 0.152: v92.35,56.39 95.1,56.39 96.7,57.99 97.23,57.99 STACK_DEC.K | v113.46,107.21 106.22,107.21 105.69,107.75 94.03,107.75 v88.85,102.56
DATAC8  (via drill 0.35)
  Top 0.152: BANKC.9 121.84,98.68 119.63,96.47 119.63,90.14 119.94,89.84 120.32,89.84 121.92,88.24 121.92,77.65 117.96,73.69 v117.96,55.09 117.27,54.41 117.27,51.13 115.82,49.68 115.82,46.41 115.06,45.64 115.06,32.92 115.67,32.31 115.67,26.14 113.54,24 113.54,22.63 112.24,21.34 v110.11,21.34 | v100.66,16.46 v98.37,16.46
  Bottom 0.152: v117.96,55.09 117.42,54.56 109.19,54.56 102.03,61.72 96.47,61.72 92.81,58.06 91.29,58.06 C_INC.K | v98.37,16.46 91.67,16.46 89.23,14.02 88.77,14.02 STACK_C.2 | v100.66,16.46 105.23,16.46 v110.11,21.34
DATAC9  (via drill 0.35)
  Top 0.152: v87.55,49.68 89.61,47.62 89.61,24.23 89.69,24.16 89.69,21.79 88.01,20.12 88.01,18.29 86.26,16.54 86.26,14.02 STACK_C.1 | v119.71,103.48 121.84,101.35 BANKC.10 | v107.67,96.93 99.52,96.93 97.46,98.98 97.46,99.14 96.85,99.75 96.16,99.75 95.56,99.14 95.56,95.86 97.99,93.42 v97.99,90.68
  Bottom 0.152: v87.55,49.68 85.34,51.89 85.34,57.99 C_DEC.K 85.34,58.06 85.57,58.29 85.57,64.16 88.7,67.28 88.77,67.28 99.52,78.03 99.52,79.86 97.99,81.38 v97.99,90.68 | v119.71,103.48 115.29,103.48 114.38,102.56 109.12,102.56 107.67,101.12 v107.67,96.93
DATAC13  (via drill 0.35)
  Top 0.152: v157.05,86.26 158.27,85.04 158.27,79.48 145.31,66.52 145.31,58.06 RESET.K | v144.78,98.83 v143.03,100.58 143.03,100.51 v141.88,99.36 | v63.02,14.33 60.5,14.33 52.43,22.4 52.43,24.61 49.07,27.96 35.51,27.96 31.7,31.77 31.7,37.11 v30.94,37.87 | v48.77,60.5 48.77,66.37 61.87,79.48 77.95,79.48 80.09,81.61 80.09,94.26 v80.7,94.87 | v97.38,93.12 v95.56,93.12
  Bottom 0.152: v157.05,86.26 157.05,86.56 v144.78,98.83 | v143.03,100.58 131.6,100.58 129.92,102.26 127.94,102.26 127.03,101.35 BANKC.14 | v63.02,14.33 64.16,15.47 69.8,15.47 70.41,14.86 70.41,13.26 71.63,12.04 72.39,12.04 74.07,13.72 74.52,13.72 HALT_RESEDT_NEXTINS.3 | v30.94,37.87 32.08,37.87 40.01,45.8 40.01,50.67 45.72,56.39 47.62,56.39 48.77,57.53 v48.77,60.5 | v80.7,94.87 82.6,94.87 84.35,93.12 v95.56,93.12 | v97.38,93.12 111.63,93.12 112.32,92.43 128.09,92.43 131.44,95.78 138.3,95.78 v141.88,99.36
DATAC14  (via drill 0.35)
  Top 0.152: v131.83,96.39 142.42,85.8 142.42,81.46 139.14,78.18 v138.68,78.18 138.23,78.18 134.49,74.45 134.49,73.99 134.19,73.69 133.58,73.69 133.27,73.99 133.27,74.6 134.8,76.12 134.8,79.02 134.49,79.32 133.88,79.32 132.36,77.8 v125.73,77.8 | v82.07,16.69 82.07,16.31 83.97,14.4 v83.97,11.73 | v93.19,17.45 93.19,28.04 90.91,30.33 90.91,43.43 v92.35,44.88 | v104.7,51.44 104.7,51.89 105.16,52.35 105.16,54.56 110.03,59.44 110.64,59.44 v112.17,57.91
  Bottom 0.152: v138.68,78.18 139.14,78.64 148.59,78.64 148.74,78.49 148.74,68.96 139.29,59.51 139.29,58.06 HALT.K | v131.83,96.39 129.54,98.68 BANKC.15 | v82.07,16.69 81.76,16.99 75.74,16.99 72.54,13.79 72.01,13.79 HALT_RESEDT_NEXTINS.2 | v83.97,11.73 84.58,11.73 85.19,12.34 86.64,12.34 87.78,13.49 87.78,15.16 88.32,15.7 90.45,15.7 92.2,17.45 v93.19,17.45 | v92.35,44.88 94.18,44.88 100.74,51.44 v104.7,51.44 | v112.17,57.91 112.17,57.61 113.39,56.39 114.07,56.39 115.37,57.68 115.37,59.21 119.48,63.32 119.48,71.55 v125.73,77.8
DATAC15  (via drill 0.35)
  Top 0.152: v136.47,75.51 136.93,75.51 142.72,81.31 v142.72,94.79 | v144.09,98.22 131.37,98.22 129.84,99.75 128.25,99.75 v128.17,99.67 | v83.29,16.84 79.4,20.73 78.94,20.73 77.72,21.95 77.72,24.08 75.29,26.52 75.29,33.53 70.87,37.95 70.87,38.56 71.17,38.86 83.67,38.86 v83.74,38.79 | v96.09,38.1 96.7,38.1 v97.31,38.71 | v105.08,43.59 111.78,43.59 v112.39,42.98 | v125.88,48.08 125.88,48.54 133.2,55.85 133.2,57.99 NEXT_INS.K
  Bottom 0.152: v136.47,75.51 136.47,61.57 133.27,58.37 133.27,58.06 NEXT_INS.K | v142.72,94.79 142.72,96.85 v144.09,98.22 | v128.17,99.67 128.17,99.97 129.46,101.27 BANKC.16 | v83.29,16.84 82.53,16.08 81.76,16.08 81.15,16.69 78.33,16.69 76.5,14.86 76.5,13.64 74.6,11.73 71.48,11.73 69.49,13.72 HALT_RESEDT_NEXTINS.1 | v83.74,38.79 90.3,38.79 90.98,38.1 v96.09,38.1 | v97.31,38.71 97.31,40.01 100.89,43.59 v105.08,43.59 | v112.39,42.98 112.39,42.52 113.16,41.76 121.92,41.76 125.88,45.72 v125.88,48.08
DIG0
  Bottom 0.152: IC27.40 146.84,16.76 146.84,16.23 147.29,15.77 150.95,15.77 153.24,18.06 154.46,18.06 U$1.PIN14
DIG1
  Bottom 0.152: IC27.41 147.68,16.84 147.68,17.45 159.11,28.88 166.12,28.88 167.03,27.96 167.03,23.01 162.15,18.14 U$1.PIN11
DIG2
  Bottom 0.152: IC27.42 148.44,16.84 148.44,17.37 159.64,28.57 165.96,28.57 166.73,27.81 166.73,24.16 162.46,19.89 161.24,19.89 160.93,19.58 160.93,17.37 161.31,16.99 163.53,16.99 164.59,18.06 U$1.PIN10
DIG3  (via drill 0.35)
  Top 0.152: v162.31,6.33 163.68,6.33 167.11,2.9 U$1.PIN6
  Bottom 0.152: v162.31,6.33 158.72,9.91 158.72,18.75 160.17,20.19 162.31,20.19 166.42,24.31 166.42,27.66 165.81,28.27 160.1,28.27 149.28,17.45 149.28,16.84 IC27.43
DP  (via drill 0.35)
  Top 0.152: v140.59,6.17 142.49,6.17 142.95,5.71 152.78,5.71 155.52,8.46 v173.35,8.46
  Bottom 0.152: v140.59,6.17 138.84,6.17 138.3,6.71 138.3,11.28 139.6,12.57 140.13,12.57 IC27.30 | v173.35,8.46 174.96,6.86 175.34,6.86 RN2.13
E  (via drill 0.35)
  Top 0.152: v153.39,2.52 153.85,2.06 177.16,2.06 v184.48,9.37
  Bottom 0.152: v153.39,2.52 141.58,2.52 137.69,6.4 137.69,13.03 139.6,14.94 140.13,14.94 IC27.33 | v184.48,9.37 184.48,10.44 183.72,11.2 176.78,11.2 176.25,10.67 175.41,10.67 RN2.16
EXTERN_BUS0  (via drill 0.35)
  Top 0.152: v153.77,9.98 153.77,14.78 156.29,17.3 162.76,17.3 163.83,18.36 163.83,18.75 168.25,23.16 183.03,23.16 183.64,22.55 v187.3,22.55 187.53,22.33 195.07,22.33 196.22,21.18 196.22,15.24 195.3,14.33 195.3,13.18 SV3.1
  Bottom 0.152: v153.77,9.98 152.4,8.61 151.87,8.61 IC27.9 | v187.3,22.55 186.61,22.55 186.46,22.4 R10.1
EXTERN_BUS1  (via drill 0.35)
  Top 0.152: v158.12,9.07 178.84,9.07 188.48,18.71 | 188.48,18.71 188.98,19.2 193.09,19.2 193.7,18.59 193.7,14.1 192.79,13.18 SV3.2 | v188.37,18.75 188.44,18.75 188.48,18.71
  Bottom 0.152: v158.12,9.07 156.9,7.85 151.87,7.85 IC27.10 | v188.37,18.75 185.85,21.26 185.85,23.47 184.63,24.69 179.98,24.69 177.62,27.05 177.62,27.58 R10.9
EXTERN_BUS2  (via drill 0.35)
  Top 0.152: v173.89,13.26 180.44,13.26 v186.31,19.13 | v188.52,17.83 v189.74,16.61
  Bottom 0.152: v173.89,13.26 170.16,13.26 162.08,5.18 161.01,5.18 159.26,6.93 151.87,6.93 IC27.11 | R10.2 185.24,22.33 185.24,21.41 186.31,20.34 v186.31,19.13 187.6,17.83 v188.52,17.83 | v189.74,16.61 191.64,14.71 193.4,14.71 194.31,15.62 195.22,15.62 SV3.3
EXTERN_BUS3
  Bottom 0.152: IC27.12 149.96,5.26 149.96,7.01 143.94,13.03 143.94,13.49 141.5,15.93 141.5,18.44 153.54,30.48 176.4,30.48 178.76,28.12 178.76,27.66 R10.10 178.84,27.58 178.84,27.13 180.75,25.22 187.6,25.22 190.5,22.33 192.48,22.33 193.7,21.11 193.7,20.95 194.92,19.74 195.07,19.74 196.22,18.59 196.22,17.75 195.68,17.22 195.45,17.22 193.93,15.7 192.79,15.7 SV3.4
EXTERN_BUS4  (via drill 0.35)
  Top 0.152: v152.17,4.19 152.63,4.19 155.98,7.54 181.74,7.54 v185.7,11.51
  Bottom 0.152: v152.17,4.19 149.66,4.19 149.28,4.57 149.28,5.18 IC27.13 | 185.7,17.22 185.7,20.12 183.95,21.87 183.95,22.33 R10.3 | 185.7,17.22 v185.7,11.51 | 185.7,17.22 193.09,17.22 194,18.14 195.22,18.14 SV3.5
EXTERN_BUS5  (via drill 0.35)
  Top 0.152: v149.43,3.58 150.34,3.58 152.17,1.75 180.9,1.75 191.72,12.57 191.72,17.14 192.71,18.14 SV3.6 | v181.74,25.83 183.49,24.08 v186.84,24.08
  Bottom 0.152: v149.43,3.58 148.44,4.57 148.44,5.18 IC27.14 | v181.74,25.83 181.36,25.83 180.14,27.05 180.14,27.58 R10.11 | v186.84,24.08 192.71,18.21 SV3.6
EXTERN_BUS6  (via drill 0.35)
  Top 0.152: v147.52,3.81 149.88,1.45 182.42,1.45 194.31,13.34 194.31,19.74 | 194.31,19.74 194.31,19.81 195.22,20.73 SV3.7 | 194.31,19.74 v184.78,19.74
  Bottom 0.152: v147.52,3.81 147.6,3.89 147.6,5.18 IC27.15 | v184.78,19.74 182.65,21.87 182.65,22.33 R10.4
EXTERN_BUS7  (via drill 0.35)
  Top 0.152: v148.51,7.47 152.17,7.47 154.38,9.68 154.38,14.94 156.44,16.99 164.97,16.99 166.04,18.06 166.04,18.9 170,22.86 182.88,22.86 184.94,20.8 192.71,20.8 SV3.8 | v182.65,25.83 186.08,25.83 v188.14,23.77
  Bottom 0.152: v148.51,7.47 146.84,5.79 146.84,5.26 IC27.16 | v182.65,25.83 181.43,27.05 181.43,27.58 R10.12 | v188.14,23.77 188.59,23.77 191.57,20.8 192.71,20.8 SV3.8
EXTERN_BUS8  (via drill 0.35)
  Top 0.152: v144.63,6.63 151.79,6.63 154.69,9.53 154.69,14.78 156.59,16.69 165.12,16.69 166.34,17.91 166.34,18.75 170.16,22.55 179.07,22.55 v180.9,20.73 | v182.57,24.08 183.49,23.16 188.44,23.16 189.51,24.23 193.17,24.23 194.08,23.32 195.22,23.32 SV3.9
  Bottom 0.152: v144.63,6.63 144.47,6.48 144.47,5.26 IC27.19 | v180.9,20.73 180.9,21.87 181.36,22.33 R10.5 181.43,22.4 181.43,22.94 v182.57,24.08
EXTERN_BUS9
  Bottom 0.152: IC27.20 143.64,5.26 143.64,13.34 141.2,15.77 141.2,19.51 152.48,30.79 179.91,30.79 182.57,28.12 182.57,27.66 R10.13 182.65,27.58 182.65,27.13 184.25,25.53 187.76,25.53 189.97,23.32 192.71,23.32 SV3.10
EXTERN_BUS10  (via drill 0.35)
  Top 0.152: v143.03,6.55 143.79,6.55 144.32,6.02 151.64,6.02 154.99,9.37 154.99,14.63 156.74,16.38 166.88,16.38 168.63,18.14 168.63,19.66 171.22,22.25 178.46,22.25 v179.98,20.73 | v181.13,24.08 181.13,26.14 181.81,26.82 193.09,26.82 194.08,25.83 195.22,25.83 SV3.11
  Bottom 0.152: v143.03,6.55 142.88,6.4 142.88,5.26 IC27.21 | v179.98,20.73 179.98,22.25 180.06,22.33 R10.6 180.14,22.4 180.14,22.94 181.13,23.93 v181.13,24.08
EXTERN_BUS11  (via drill 0.35)
  Top 0.152: v142.88,7.47 140.97,7.47 139.98,6.48 139.98,5.87 140.44,5.41 152.93,5.41 155.37,7.85 181.13,7.85 185.4,12.12 v189.43,12.12
  Bottom 0.152: v142.88,7.47 142.04,6.63 142.04,5.26 IC27.22 | v189.43,12.12 193.09,12.12 194.31,13.34 194.31,13.49 195.53,14.71 195.68,14.71 196.52,15.54 196.52,20.88 195.07,22.33 194.84,22.33 193.7,23.47 193.7,24.84 192.79,25.76 SV3.12 192.71,25.83 185.17,25.83 183.95,27.05 183.95,27.58 R10.14
EXTERN_BUS12  (via drill 0.35)
  Top 0.152: v138.91,7.01 139.06,7.01 144.86,12.8 144.86,13.03 146.38,14.55 150.65,14.55 v152.02,15.93 | v155.6,14.33 164.29,14.33 166.04,16.08 167.03,16.08 168.94,17.98 168.94,19.51 171.07,21.64 v176.56,21.64 | v178.76,24.23 181.66,27.13 192.86,27.13 194.08,28.35 195.22,28.35 SV3.13
  Bottom 0.152: v138.91,7.01 140.13,7.01 IC27.23 | v152.02,15.93 152.63,16.54 153.39,16.54 v155.6,14.33 | v176.56,21.64 177.16,21.03 177.93,21.03 178.76,21.87 178.76,22.33 R10.7 178.76,22.4 v178.76,24.23
EXTERN_BUS13  (via drill 0.35)
  Top 0.152: v138.91,8.53 138.91,9.22 152.63,22.94 152.63,24.23 v154.23,25.83 | v156.97,28.57 160.71,28.57 166.73,34.59 v178,34.59
  Bottom 0.152: v138.91,8.53 139.6,7.85 140.13,7.85 IC27.24 | v156.97,28.57 v154.23,25.83 | v178,34.59 190.42,34.59 193.7,31.32 193.7,29.34 192.79,28.42 SV3.14 192.71,28.35 190.58,26.21 186.08,26.21 185.24,27.05 185.24,27.58 R10.15
EXTERN_BUS14  (via drill 0.35)
  Top 0.152: v141.5,8.38 141.2,8.38 139.22,6.4 138.61,6.4 138.3,6.71 138.3,7.32 138.91,7.92 139.52,7.92 144.55,12.95 144.55,13.18 146.23,14.86 149.28,14.86 162.99,28.57 v171.98,28.57 | v177.62,24.08 182.88,29.34 192.56,29.34 194.08,30.86 195.22,30.86 SV3.15
  Bottom 0.152: v141.5,8.38 141.35,8.53 140.21,8.53 IC27.25 | v171.98,28.57 171.98,28.12 176.82,23.28 | 176.82,23.28 177.55,22.55 177.55,22.4 R10.8 | 176.82,23.28 v177.62,24.08
EXTERN_BUS15  (via drill 0.35)
  Top 0.152: v138.91,10.13 138.91,11.05 146.15,18.29 146.15,21.72 152.4,27.96 160.55,27.96 166.57,33.98 v178.69,33.98
  Bottom 0.152: v138.91,10.13 139.6,9.45 140.13,9.45 IC27.26 | v178.69,33.98 181.13,33.98 182.88,32.23 182.88,32 PULL_DOWN.1 182.96,31.93 183.95,30.94 192.71,30.94 SV3.16
F  (via drill 0.35)
  Top 0.152: v142.42,13.64 142.42,14.1 152.32,24 v152.32,24.84 | v171.37,21.03 171.37,13.03 v173.89,10.52
  Bottom 0.152: v142.42,13.64 141.88,14.17 140.21,14.17 IC27.32 | v152.32,24.84 154.61,24.84 158.95,29.18 167.49,29.18 169.54,27.13 169.54,22.86 v171.37,21.03 | v173.89,10.52 175.03,9.37 175.34,9.37 RN2.15
G  (via drill 0.35)
  Top 0.152: v140.59,4.8 150.65,4.8 151.87,3.58 153.69,3.58 157.05,6.93 v170.92,6.93
  Bottom 0.152: v140.59,4.8 139.75,4.8 138,6.55 138,11.73 139.6,13.34 140.13,13.34 IC27.31 | v170.92,6.93 173.05,9.07 174.04,9.07 174.96,8.15 175.34,8.15 RN2.14
GND  (via drill 0.35)
  Top 0.457: 187.45,47.55 188.44,46.56 188.44,45.95 IC5.8 | v186.08,47.55 187.45,47.55 | v141.66,11.05 v146.07,15.47 | v146.23,12.19 146.38,12.19 147.52,11.05 v150.5,11.05 | v176.1,31.39 176.1,31.24 170.69,25.83 166.57,25.83 165.51,24.77 SV5.1 | IC3.8 16,116.59 17.14,116.59 19.05,118.49 19.05,124.36 20.88,126.19 67.13,126.19 71.09,122.22 SV2.2 | IC21.4 159.94,98.6 159.94,97.38 IC21.5 160.17,97.38 v162.76,97.38 | 173.58,84.66 169.32,88.92 169.32,90.45 v168.55,91.21 | 173.58,84.66 179.3,78.94 180.14,78.94 180.52,79.32 180.52,81 IC22.8 | v164.52,93.57 159.94,93.57 IC21.8 | IC22.5 184.4,81.08 IC22.4 185.62,81.31 185.62,83.21 | v186.31,83.9 185.62,83.21 | IC23.8 158.95,108.58 160.02,108.58 161.24,109.8 161.24,110.72 159.64,112.32 158.95,112.32 IC23.5 158.72,112.47 151.64,112.47 v146.69,117.42 | 188.75,121.77 195.45,128.47 195.45,135.03 187.6,142.88 187.6,148.97 POWER_PINS.3 | 188.75,121.77 187.15,121.77 186.08,122.83 R1.1 186,123.06 172.06,123.06 166.95,128.17 IC10.7 166.73,128.25 v136.55,128.25 136.4,128.09 135.71,128.09 126.11,118.49 v124.59,118.49 | 188.75,121.77 192.48,118.03 192.48,101.65 J1.1 | v175.03,86.11 173.58,84.66 | v179.53,86.18 182.65,86.18 185.62,83.21 | v187.6,49.91 187.6,47.7 187.45,47.55
  Bottom 0.457: R10.16 186.38,27.66 186.38,28.35 185.62,29.11 183.79,29.11 181.89,31.01 181.89,31.09 181.05,31.93 PULL_DOWN.2 180.82,32.08 179.38,32.08 178.08,33.38 | v186.08,47.55 186.08,43.81 177.24,34.98 177.24,34.21 178.08,33.38 | IC27.29 140.21,11.73 140.21,11.05 IC27.28 140.44,11.05 141.28,11.05 141.43,10.9 | 141.43,10.9 142.88,9.45 142.88,8.61 141.35,7.09 141.35,4.27 141.58,4.04 144.78,4.04 145.16,4.42 145.16,5.18 IC27.18 | v141.66,11.05 141.58,11.05 141.43,10.9 | IC27.39 146.07,16.76 v146.07,15.47 146.23,15.32 v146.23,12.19 | SV5.1 165.43,24.69 163.98,24.69 158.27,18.97 158.27,14.94 154.38,11.05 151.87,11.05 IC27.6 151.64,11.05 v150.5,11.05 | v176.1,31.39 178.08,33.38 | SV2.2 71.17,122.15 73.61,119.71 SV2.3 73.84,119.56 74.68,119.56 75.74,118.49 v124.59,118.49 | v168.55,91.21 168.4,91.21 168.33,91.14 167.56,91.14 166.12,92.58 166.12,93.5 IC1.8 165.89,93.57 v164.52,93.57 162.92,95.17 162.92,97.31 | 162.92,97.31 163.3,97.69 164.06,97.69 164.36,97.38 166.04,97.38 IC1.5 | v162.76,97.38 162.92,97.31 | 189.51,83.9 189.51,98.6 192.48,101.58 J1.1 | 189.51,83.9 189.51,81.08 IC4.8 189.66,80.92 190.19,80.39 190.19,55.78 187.6,53.19 v187.6,49.91 | 189.51,83.9 v186.31,83.9 | U$4.8 135.56,129.24 v136.55,128.25 146.69,118.11 v146.69,117.42 | v175.03,86.11 179.45,86.11 v179.53,86.18
IN_BUS0  (via drill 0.35)
  Top 0.152: STEP_PINS.1 83.82,139.98 86.03,139.98 102.79,123.22 102.79,120.85 103.56,120.09 124.89,120.09 126.95,122.15 JP3.20 127.03,122.22 138.91,134.11 v140.36,134.11
  Bottom 0.152: STEP1.K 152.25,146.99 141.96,136.7 141.96,136.09 U$4.14 141.88,136.02 141.88,135.64 v140.36,134.11
IN_BUS1
  Bottom 0.152: 143.98,144.74 146.23,146.99 STEP2.K | 143.98,144.74 140.66,141.43 140.66,136.09 U$4.13 | STEP_PINS.2 81.31,139.98 81.31,129.46 87.86,122.91 87.86,121.01 88.77,120.09 99.59,120.09 101.65,122.15 JP3.10 101.65,122.22 105.08,125.65 105.08,144.86 105.92,145.69 108.66,145.69 111.86,148.9 140.36,148.9 141.2,148.06 141.2,147.52 143.98,144.74
IN_BUS2
  Top 0.152: STEP_PINS.3 78.72,139.98 78.26,139.98 76.58,138.3 75.82,138.3 75.21,138.91 75.21,145.09 76.43,146.3 76.58,146.3 77.42,147.14 77.42,149.2 78.18,149.96 137.31,149.96 140.21,147.07 STEP3.K 140.21,146.99 124.51,131.29 124.51,122.22 JP3.19
  Bottom 0.152: U$4.12 139.37,136.09 139.37,146.15 140.21,146.99 STEP3.K
IN_BUS3
  Top 0.152: 78.3,141.62 78.33,141.66 79.17,141.66 80.01,140.82 80.01,121.23 80.85,120.4 97.23,120.4 98.98,122.15 JP3.9 | 78.3,141.62 76.73,140.06 76.2,140.06 STEP_PINS.4 | 78.3,141.62 77.72,142.19 77.72,149.05 78.33,149.66 131.06,149.66 133.66,147.07 134.26,147.07 STEP4.K
  Bottom 0.152: U$4.11 138.07,136.09 138.07,143.26 134.34,146.99 STEP4.K
IN_BUS4
  Top 0.152: SV1.9 101.35,144.78 102.49,144.78 103.71,146 109.42,146 121.84,133.58 121.84,122.22 JP3.18
IN_BUS5
  Bottom 0.152: SV1.10 101.27,147.22 101.27,146.07 99.75,144.55 99.75,125.42 96.55,122.22 JP3.8
IN_BUS6